# EAGLE design eletric (EAGLE 4.11)
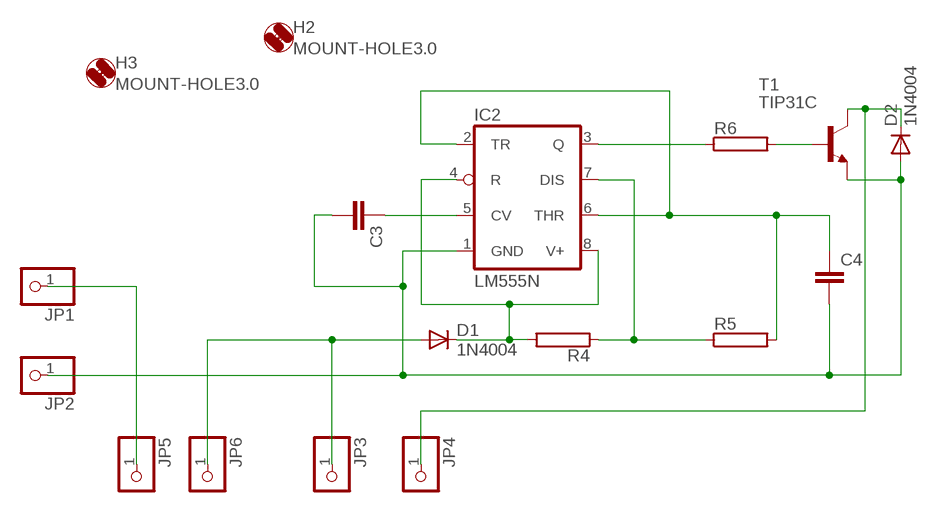
[diagram p0: schematic, sheet 1]

## Parts
C3  C5/2.5  [C5B2.5]
C4  C5/2.5  [C5B2.5]
D1  1N4004  [DO41-10]
D2  1N4004  [DO41-10]
H2  MOUNT-HOLE3.0  [3,0]
H3  MOUNT-HOLE3.0  [3,0]
IC2  LM555N  [DIL08]
JP1  PINHD-1X1  [1X01]
JP2  PINHD-1X1  [1X01]
JP3  PINHD-1X1  [1X01]
JP4  PINHD-1X1  [1X01]
JP5  PINHD-1X1  [1X01]
JP6  PINHD-1X1  [1X01]
R4  RKH206-8R  [KH206-8R]
R5  RKH206-8R  [KH206-8R]
R6  RKH206-8R  [KH206-8R]
T1  TIP31C  [TO220]

## Nets
N$1: IC2.3(Q) R6.1
N$2: C4.1 IC2.2(TR) IC2.6(THR) R5.2
N$3: R6.2 T1.1(B)
N$4: IC2.7(DIS) R4.1 R5.1
N$5: D1.C IC2.4(R) IC2.8(V+) R4.2
N$6: C3.2 C4.2 D2.A IC2.1(GND) JP2.1 T1.3(E)
N$7: D2.C JP4.1 T1.2(C)
N$8: C3.1 IC2.5(CV)
N$9: JP1.1 JP5.1
N$10: D1.A JP3.1 JP6.1

## Library data of the parts
C3 C4 = capacitor-wima:C: CAPACITOR naming: grid - package width
D1 D2 = diode:1N4004: DIODE general purpose rectifier, 1 A
H2 H3 = holes:MOUNT-HOLE: MOUNTING HOLE with drill center marker
IC2 = linear:*555: TIMER
JP1-JP6 = pinhead:PINHD-1X1: PIN HEADER
R4-R6 = resistor-power:R: Power Resitor
T1 = transistor:TIP31C: NPN TRANSISTOR

## Board
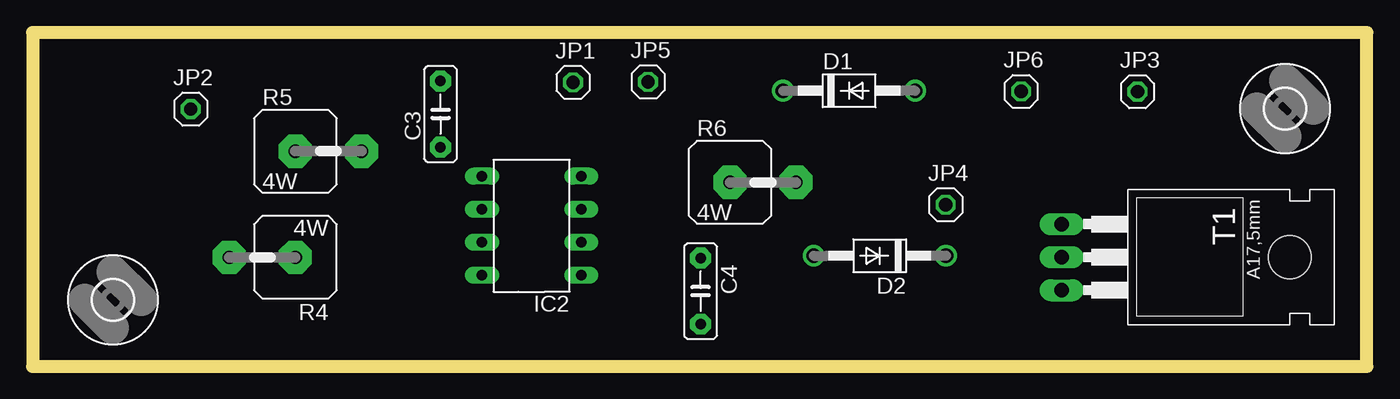
[diagram p1: board, top side]
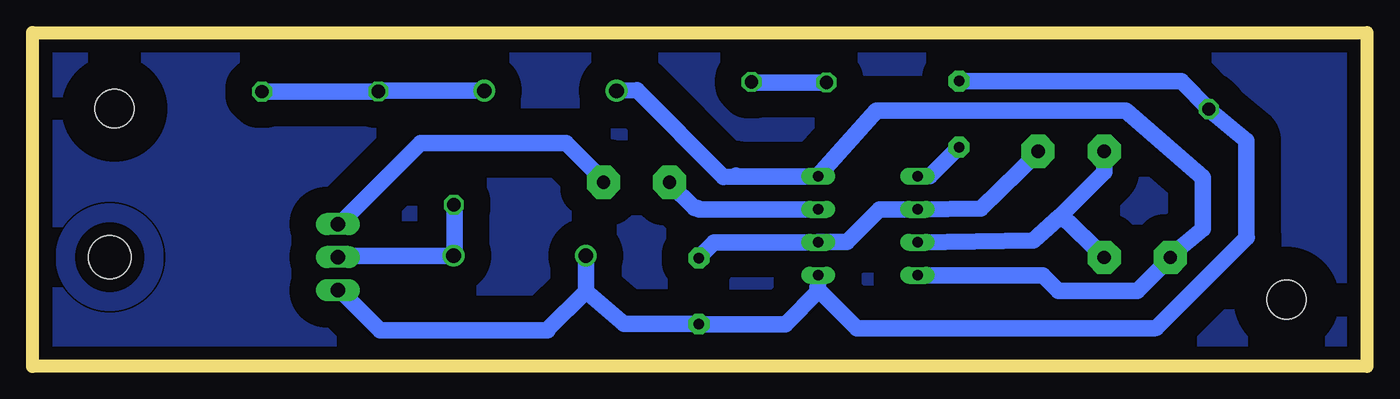
[diagram p2: board, bottom side, seen from below]

Size 102.55 x 25.68 mm. Coordinates in mm from the lower left corner, seen from the top.
Outline: 0,0 102.55,0 102.55,25.68 0,25.68 0,0
Copper layers 16: Bottom 0.035mm
Design rules "default": minimum track width 10mil, minimum drill 24mil, track to track 80mil, track to pad 30mil, pad to pad 30mil, via to via 30mil, smd to smd 30mil, copper to edge 40mil, drill to drill 8mil, minimum pad ring 10mil, minimum via ring 8mil, stop-mask expansion 4mil, vias tented up to drill 0mil, thermal gap 10mil

### Footprints (pad centres in the part's own frame; a part is rotated, then mirrored left to right if it is on the bottom)
C5B2.5 = drill 0.813 pad 1.6 octagon: 1 -2.54,0; 2 2.54,0
DO41-10 = drill 1.118 round: A 5.08,0; C -5.08,0
3,0 = hole 3: 0,0
DIL08 = drill 0.813 long: 1 -3.81,-3.81; 2 -1.27,-3.81; 3 1.27,-3.81; 4 3.81,-3.81; 5 3.81,3.81; 6 1.27,3.81; 7 -1.27,3.81; 8 -3.81,3.81
1X01 = drill 1.016 octagon: 1 0,0
KH206-8R = drill 1.016 pad 2.54 octagon: 1 -2.54,0; 2 2.54,0
TO220 = drill 1.118 long: 1 -2.54,-6.35; 2 0,-6.35; 3 2.54,-6.35 | hole 3.302: 0,11.176

### Placement (x,y rotation side)
C3  31.35,19.4 90 top
C4  51.34,5.79 270 top
D1  62.75,21.2 0 top
D2  65.11,8.51 180 top
H2  96.25,19.82 0 top
H3  6.18,5.12 0 top
IC2  38.35,10.81 90 top
JP1  41.53,21.84 0 top
JP2  12.16,19.78 0 top
JP3  84.91,21.13 0 top
JP4  70.17,12.43 0 top
JP5  47.3,21.88 0 top
JP6  75.97,21.14 0 top
R4  17.66,8.39 180 top
R5  22.74,16.54 0 top
R6  56.13,14.16 0 top
T1  85.44,8.4 270 top

### Tracks (layer width: path | path; a pad name or v marks a point on that pad's centre or on a via)
N$1
  Bottom 1.27: IC2.3 51.34,12.08 51.43,12.17 51.68,12.17 53.59,14.08 R6.1
N$2
  Bottom 1.27: R5.2 25.28,16.52 25.23,16.47 29.67,12.13 IC2.6 37.47,12.08 39.98,9.57 42.18,9.57 42.21,9.54 | 42.21,9.54 42.23,9.52 | 42.21,9.54 IC2.2 50.16,9.54 51.37,8.33 | 51.37,8.33 51.38,8.32 | 51.37,8.33 C4.1
N$3
  Bottom 1.27: R6.2 58.67,14.31 61.53,17.17 72.73,17.17 79.08,10.82 79.09,10.83 T1.1
N$4
  Bottom 1.27: R4.1 20.21,8.47 | 20.21,8.47 20.21,8.45 20.18,8.42 | 20.21,8.47 20.23,8.47 23.5,11.59 25.63,9.69 | 25.63,9.69 IC2.7 | 25.63,9.69 23.58,11.57 20.2,14.95 R5.1
N$5
  Bottom 1.27: IC2.8 24.91,7 23.73,5.82 17.63,5.82 15.12,8.33 R4.2 15.12,8.48 12.63,10.57 12.63,14.52 18.53,19.67 37.68,19.67 42.21,14.59 | 42.21,14.59 IC2.4 | 42.21,14.59 48.38,14.59 | 48.38,14.59 48.4,14.59 48.48,14.67 | 48.38,14.59 49.43,14.57 56.11,21.25 D1.C
N$6
  Bottom 1.27: 60.03,5.77 D2.A | 60.03,5.77 57.08,3.27 51.43,3.27 51.34,3.18 | 51.34,3.18 51.33,3.17 | 51.34,3.18 C4.2 44.7,3.25 42.11,5.84 | T1.3 78.92,5.86 75.83,2.77 63.03,2.77 | 63.03,2.77 62.98,2.77 | 60.03,5.77 63.03,2.77 | IC2.1 42.21,5.95 42.11,5.84 | 42.11,5.84 39.18,2.92 16.33,2.92 16.28,2.97 16.18,2.97 9.23,9.92 9.28,9.97 9.28,17.37 12.2,19.79 JP2.1 12.15,19.79 | C3.2 14.9,21.94 14.88,21.92 14.28,21.92 12.15,19.79 | 12.15,19.79 12.13,19.77 | 42.11,5.84
N$7
  Bottom 1.27: 78.98,8.47 79.08,8.37 79.09,8.38 T1.2 79.06,8.4 79.03,8.37 78.89,8.51 D2.C 70.11,8.51 70.11,12.43 JP4.1
N$8
  Bottom 1.27: C3.1 33.58,14.62 IC2.5
N$9
  Bottom 1.27: 47.31,21.84 47.3,21.85 JP5.1 | JP1.1 47.31,21.84 | 47.31,21.84 47.33,21.82
N$10
  Bottom 1.27: 76.06,21.2 76,21.14 JP6.1 75.98,21.12 75.99,21.13 JP3.1 | D1.A 76.06,21.2 | 76.06,21.2 76.08,21.22
N$11
  pour Bottom: 0.74,0.47 102.64,0.47 102.64,25.64 -0.15,25.53 -0.15,0.47 0.74,0.58